# EAGLE design PlaybackStylophone (EAGLE 9.6.2)
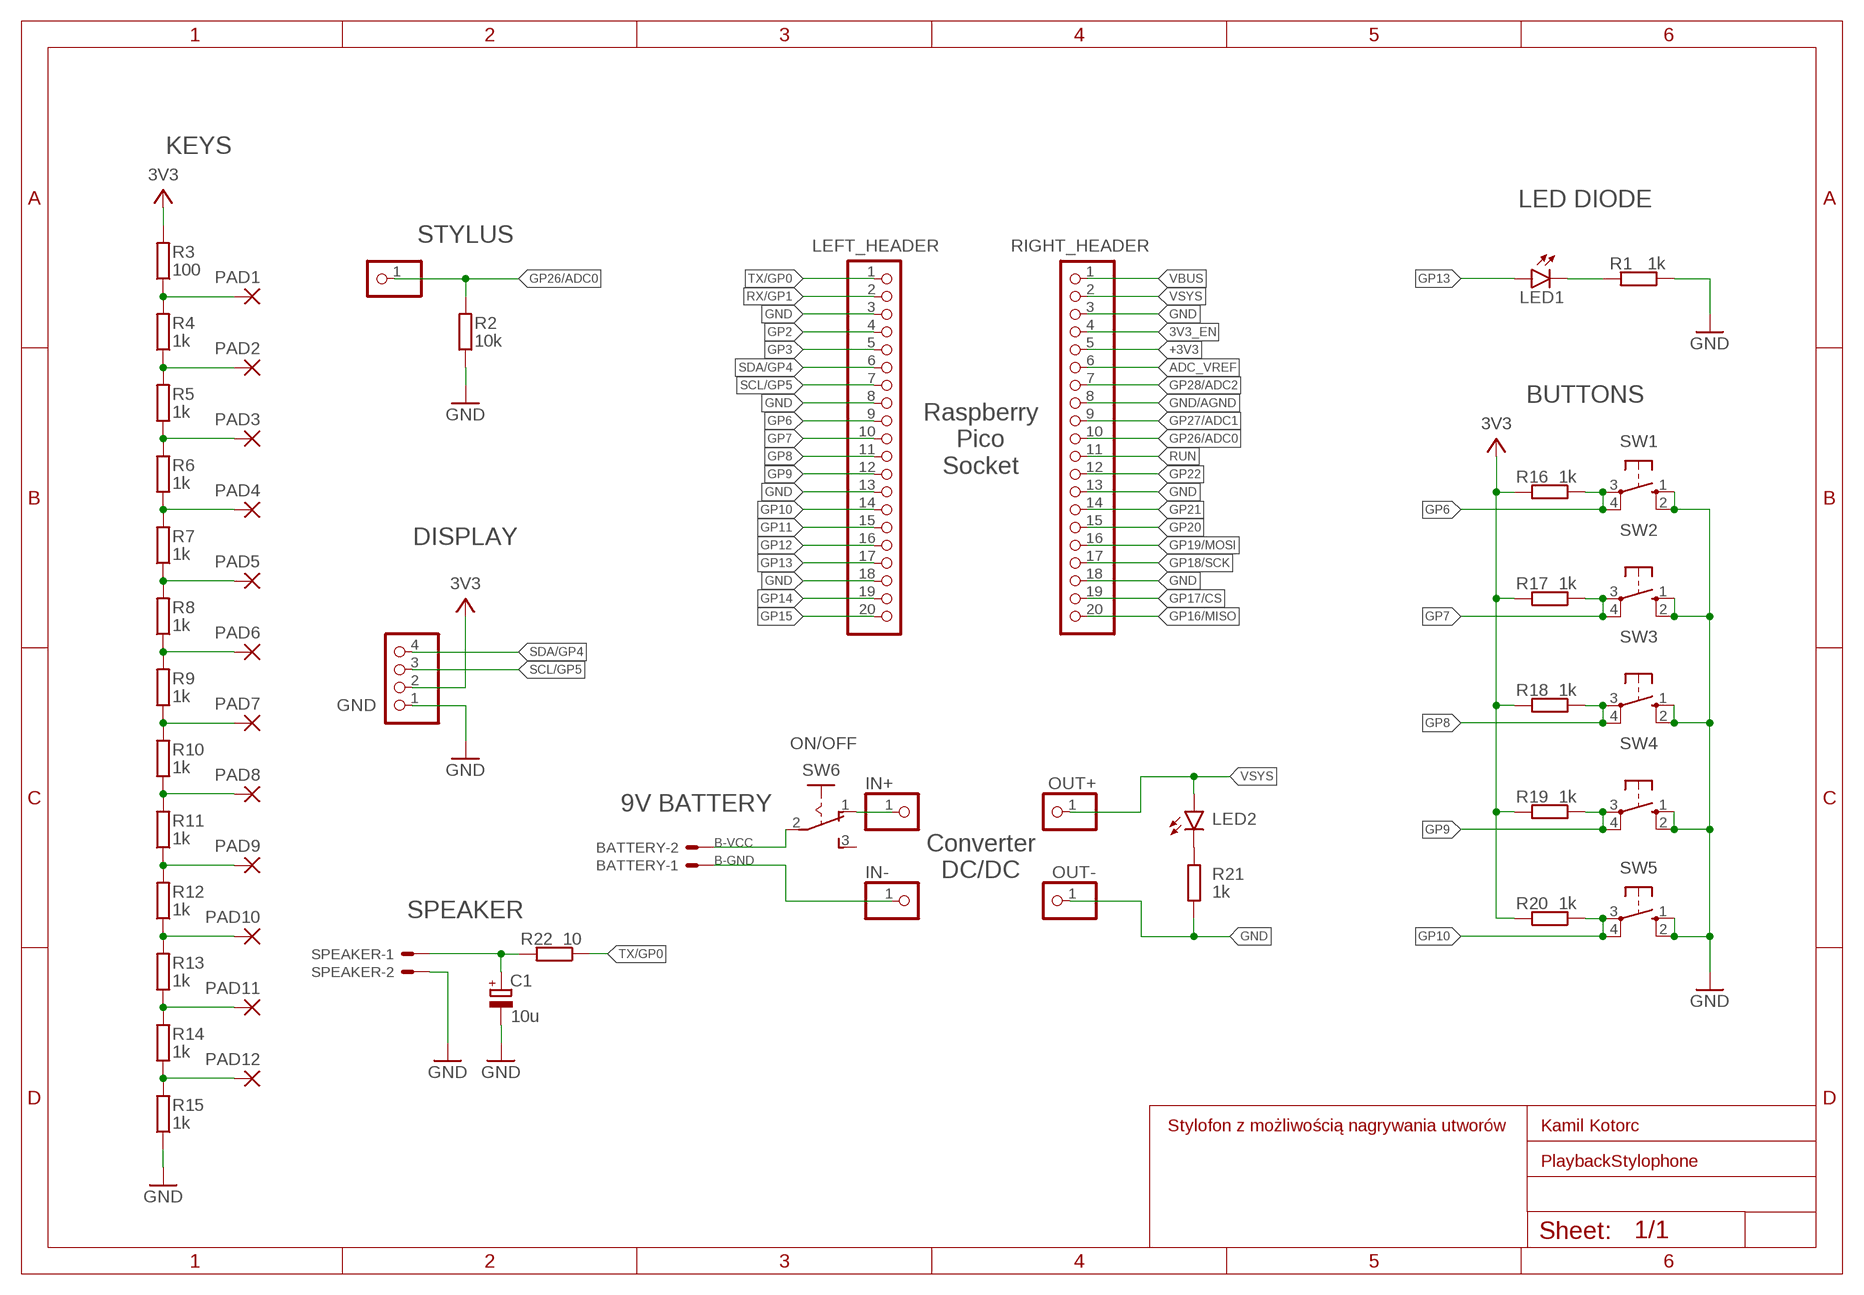
[diagram p0: schematic, sheet 1]
FRAME1 (A4L-LOC): AUTHOR: Kamil Kotorc; PROJECT: Stylofon z możliwością nagrywania utworów

## Parts
BATTERY  9V BATTERY  22-23-2021  [22-23-2021]
C1  10u  CPOL-EUE2.5-5  [E2,5-5]
DISPLAY  GND  PINHD-1X4  [1X04]
IN+  PINHD-1X1  [1X01]
IN-  PINHD-1X1  [1X01]
LED1  LED5MM  [LED5MM]
LED2  LED3MM  [LED3MM]
LEFT_HEADER  PINHD-1X20  [1X20]
OUT+  PINHD-1X1  [1X01]
OUT-  PINHD-1X1  [1X01]
PAD1  SMD5  [SMD2,54-5,08]
PAD2  SMD5  [SMD2,54-5,08]
PAD3  SMD5  [SMD2,54-5,08]
PAD4  SMD5  [SMD2,54-5,08]
PAD5  SMD5  [SMD2,54-5,08]
PAD6  SMD5  [SMD2,54-5,08]
PAD7  SMD5  [SMD2,54-5,08]
PAD8  SMD5  [SMD2,54-5,08]
PAD9  SMD5  [SMD2,54-5,08]
PAD10  SMD5  [SMD2,54-5,08]
PAD11  SMD5  [SMD2,54-5,08]
PAD12  SMD5  [SMD2,54-5,08]
R1  1k  R-EU_0204/7  [0204/7]
R2  10k  R-EU_0204/7  [0204/7]
R3  100  R-EU_0204/7  [0204/7]
R4  1k  R-EU_0204/7  [0204/7]
R5  1k  R-EU_0204/7  [0204/7]
R6  1k  R-EU_0204/7  [0204/7]
R7  1k  R-EU_0204/7  [0204/7]
R8  1k  R-EU_0204/7  [0204/7]
R9  1k  R-EU_0204/7  [0204/7]
R10  1k  R-EU_0204/7  [0204/7]
R11  1k  R-EU_0204/7  [0204/7]
R12  1k  R-EU_0204/7  [0204/7]
R13  1k  R-EU_0204/7  [0204/7]
R14  1k  R-EU_0204/7  [0204/7]
R15  1k  R-EU_0204/7  [0204/7]
R16  1k  R-EU_0204/7  [0204/7]
R17  1k  R-EU_0204/7  [0204/7]
R18  1k  R-EU_0204/7  [0204/7]
R19  1k  R-EU_0204/7  [0204/7]
R20  1k  R-EU_0204/7  [0204/7]
R21  1k  R-EU_0204/7  [0204/7]
R22  10  R-EU_0204/7  [0204/7]
RIGHT_HEADER  PINHD-1X20  [1X20]
SPEAKER  SPEAKER  22-23-2021  [22-23-2021]
STYLUS  PINHD-1X1  [1X01]
SW1  10-XX  [B3F-10XX]
SW2  10-XX  [B3F-10XX]
SW3  10-XX  [B3F-10XX]
SW4  10-XX  [B3F-10XX]
SW5  10-XX  [B3F-10XX]
SW6  ON/OFF  255SB  [255SB]

## Nets
3V3_EN: RIGHT_HEADER.4
+3V3: DISPLAY.2 R3.2 R16.2 R17.2 R18.2 R19.2 R20.2 RIGHT_HEADER.5 ; supply symbol labelled 3V3
ADC_VREF: RIGHT_HEADER.6
B-GND: BATTERY.1 IN-.1
B-SW: IN+.1 SW6.1(O)
B-VCC: BATTERY.2 SW6.2(P)
GND: C1.- DISPLAY.1 LEFT_HEADER.3 LEFT_HEADER.8 LEFT_HEADER.13 LEFT_HEADER.18 OUT-.1 R1.1 R2.1 R15.1 R21.1 RIGHT_HEADER.3 RIGHT_HEADER.13 RIGHT_HEADER.18 SPEAKER.2 SW1.1(S) SW1.2(S1) SW2.1(S) SW2.2(S1) SW3.1(S) SW3.2(S1) SW4.1(S) SW4.2(S1) SW5.1(S) SW5.2(S1)
GND/AGND: RIGHT_HEADER.8
GP2: LEFT_HEADER.4
GP3: LEFT_HEADER.5
GP6: LEFT_HEADER.9 R16.1 SW1.3(P) SW1.4(P1)
GP7: LEFT_HEADER.10 R17.1 SW2.3(P) SW2.4(P1)
GP8: LEFT_HEADER.11 R18.1 SW3.3(P) SW3.4(P1)
GP9: LEFT_HEADER.12 R19.1 SW4.3(P) SW4.4(P1)
GP10: LEFT_HEADER.14 R20.1 SW5.3(P) SW5.4(P1)
GP11: LEFT_HEADER.15
GP12: LEFT_HEADER.16
GP13: LED1.A LEFT_HEADER.17
GP14: LEFT_HEADER.19
GP15: LEFT_HEADER.20
GP16/MISO: RIGHT_HEADER.20
GP17/CS: RIGHT_HEADER.19
GP18/SCK: RIGHT_HEADER.17
GP19/MOSI: RIGHT_HEADER.16
GP20: RIGHT_HEADER.15
GP21: RIGHT_HEADER.14
GP22: RIGHT_HEADER.12
GP26/ADC0: R2.2 RIGHT_HEADER.10 STYLUS.1
GP27/ADC1: RIGHT_HEADER.9
GP28/ADC2: RIGHT_HEADER.7
LED: LED1.K(C) R1.2
N$1: C1.+ R22.2 SPEAKER.1
N$13: LED2.K(C) R21.2
P1: PAD1.1(P) R3.1 R4.2
P2: PAD2.1(P) R4.1 R5.2
P3: PAD3.1(P) R5.1 R6.2
P4: PAD4.1(P) R6.1 R7.2
P5: PAD5.1(P) R7.1 R8.2
P6: PAD6.1(P) R8.1 R9.2
P7: PAD7.1(P) R9.1 R10.2
P8: PAD8.1(P) R10.1 R11.2
P9: PAD9.1(P) R11.1 R12.2
P10: PAD10.1(P) R12.1 R13.2
P11: PAD11.1(P) R13.1 R14.2
P12: PAD12.1(P) R14.1 R15.2
RUN: RIGHT_HEADER.11
RX/GP1: LEFT_HEADER.2
SCL/GP5: DISPLAY.3 LEFT_HEADER.7
SDA/GP4: DISPLAY.4 LEFT_HEADER.6
TX/GP0: LEFT_HEADER.1 R22.1
VBUS: RIGHT_HEADER.1
VSYS: LED2.A OUT+.1 RIGHT_HEADER.2
Unconnected: SW6.3(S)

## Notes on the sheet
- KEYS
- LED DIODE
- BUTTONS
- Raspberry
  Pico
  Socket
- Converter
  DC/DC

## Library data of the parts
BATTERY SPEAKER = con-molex:22-23-2021: .100" (2.54mm) Center Header - 2 Pin; MF: MOLEX; MPN: 22-23-2021; OC_FARNELL: 1462926; OC_NEWARK: 25C3832
C1 = rcl:CPOL-EU: POLARIZED CAPACITOR, European symbol; SPICEPREFIX: C
DISPLAY = pinhead:PINHD-1X4: PIN HEADER
IN+ IN- OUT+ OUT- STYLUS = pinhead:PINHD-1X1: PIN HEADER
LED1 LED2 = led:LED: LED OSRAM: - CHIPLED LG R971, LG N971, LY N971, LG Q971, LY Q971, LO R971, LY R971 LH N974, LH R974 LS Q976, LO Q976, LY Q976 LO Q996 - Hyper CHIPLED LW Q18S LB Q993, LB Q99A, LB R99A - SideLED LS A670, LO A670, LY A670, LG A670, LP A670 LB A673, LV A673, LT A673, LW A673 LH A674 LY A675 LS A676, LA A676, LO A676, LY A676, LW A676 LS A679, LY A679, LG A679 - Hyper Micro SIDELED® LS Y876, LA Y876, LO Y876, LY Y876 LT Y87S - SmartLED LW L88C, LW L88S LB L89C, LB L89S, LG L890 LS L89K, LO L89K, LY L89K LS L896, LA L896, LO L896, LY L896 - TOPLED LS T670, LO T670, LY T670, LG T670, LP T670 LSG T670, LSP T670, LSY T670, LOP T670, LYG T670 LG T671, LOG T671, LSG T671 LB T673, LV T673, LT T673, LW T673 LH T674 LS T676, LA T676, LO T676, LY T676, LB T676, LH T676, LSB T676, LW T676 LB T67C, LV T67C, LT T67C, LS T67K, LO T67K, LY T67K, LW E67C LS E67B, LA E67B, LO E67B, LY E67B, LB E67C, LV E67C, LT E67C LW T67C LS T679, LY T679, LG T679 LS T770, LO T770, LY T770, LG T770, LP T770 LB T773, LV T773, LT T773, LW T773 LH T774 LS E675, LA E675, LY E675, LS T675 LS T776, LA T776, LO T776, LY T776, LB T776 LHGB T686 LT T68C, LB T68C - Hyper Mini TOPLED® LB M676 - Mini TOPLED Santana® LG M470 LS M47K, LO M47K, LY M47K Source: http://www.osram.convergy.de LUXEON: - LUMILED® LXK2-PW12-R00, LXK2-PW12-S00, LXK2-PW14-U00, LXK2-PW14-V00 LXK2-PM12-R00, LXK2-PM12-S00, LXK2-PM14-U00 LXK2-PE12-Q00, LXK2-PE12-R00, LXK2-PE12-S00, LXK2-PE14-T00, LXK2-PE14-U00 LXK2-PB12-K00, LXK2-PB12-L00, LXK2-PB12-M00, LXK2-PB14-N00, LXK2-PB14-P00, LXK2-PB14-Q00 LXK2-PR12-L00, LXK2-PR12-M00, LXK2-PR14-Q00, LXK2-PR14-R00 LXK2-PD12-Q00, LXK2-PD12-R00, LXK2-PD12-S00 LXK2-PH12-R00, LXK2-PH12-S00 LXK2-PL12-P00, LXK2-PL12-Q00, LXK2-PL12-R00 Source: www.luxeon.com KINGBRIGHT: KA-3528ASYC Source: www.kingbright.com
LEFT_HEADER RIGHT_HEADER = pinhead:PINHD-1X20: PIN HEADER
PAD1-PAD12 = wirepad:SMD5: SMD PAD
R1-R22 = rcl:R-EU_: RESISTOR, European symbol; SPICEPREFIX: R
SW1-SW5 = switch-omron:10-XX: OMRON SWITCH; MPN: B3F-1000; OC_FARNELL: 176432; OC_NEWARK: 36M3542
SW6 = switch:255SB: SLIDING SWITCH Distributor Buerklin, 11G810

## Board
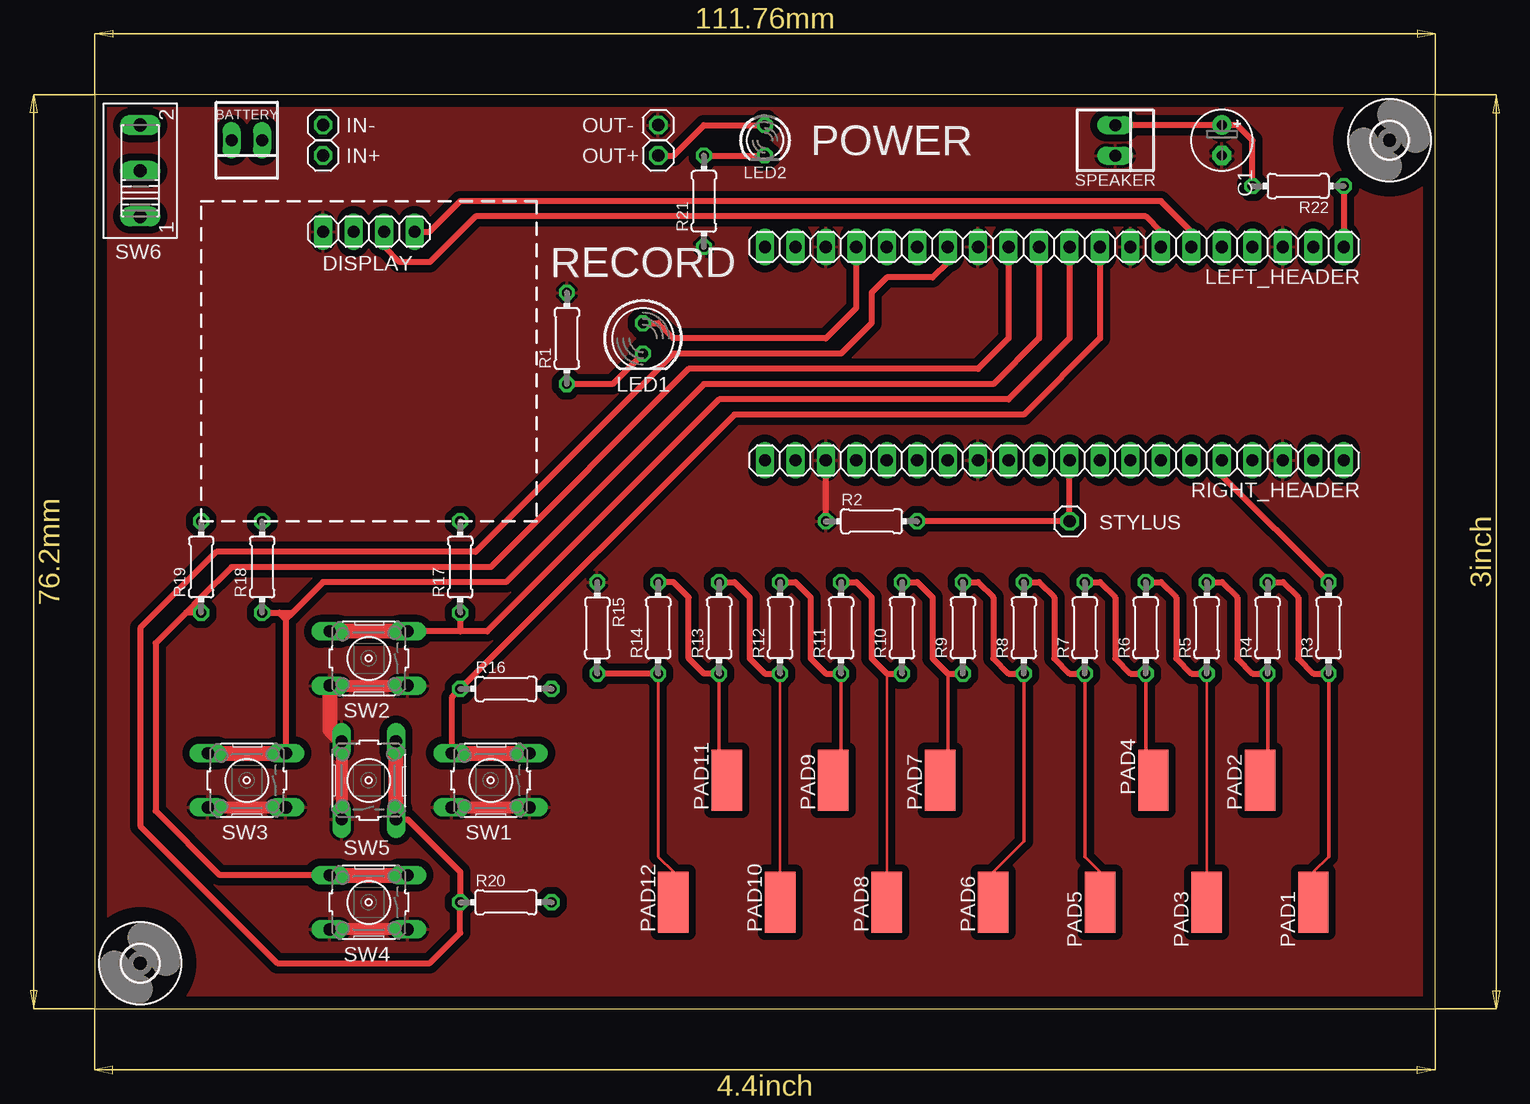
[diagram p1: board, top side]
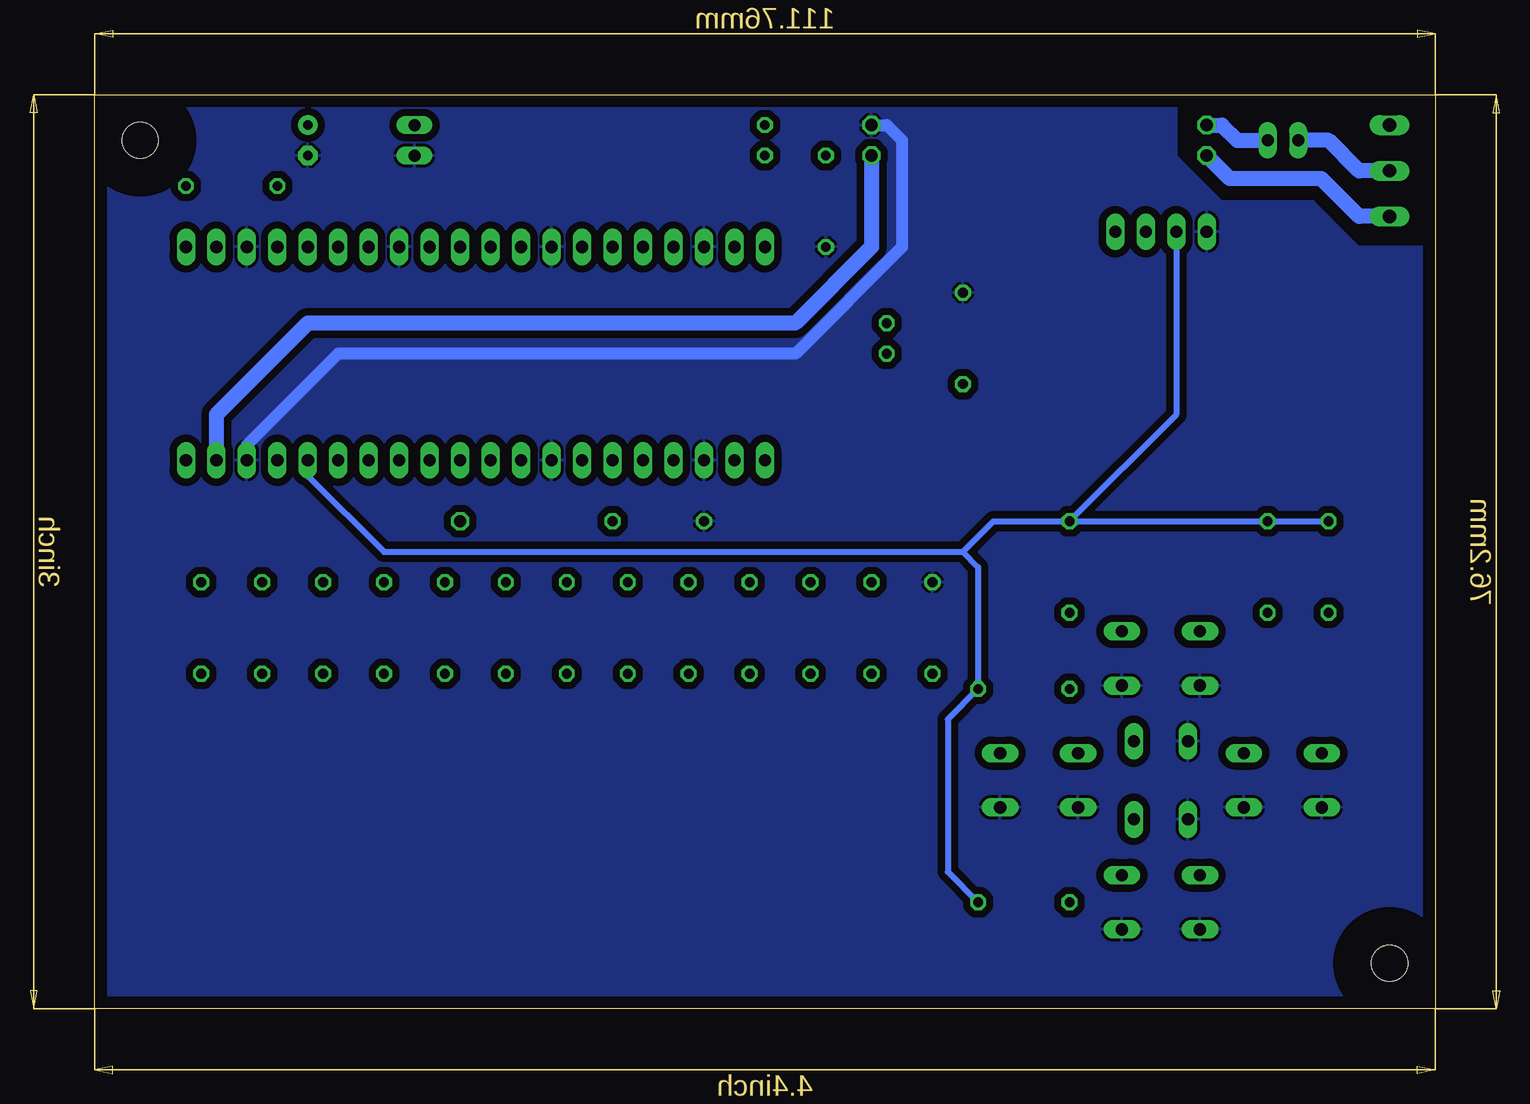
[diagram p2: board, bottom side, seen from below]

Size 111.76 x 76.2 mm. Coordinates in mm from the lower left corner, seen from the top.
Outline: 0,0 111.76,0 111.76,76.2 0,76.2 0,0
Copper layers (1*16): Top 0.035mm / dielectric 1.5mm / Bottom 0.035mm
Design rules "default": minimum track width 6mil, minimum drill 0.35mm, track to track 6mil, track to pad 6mil, pad to pad 6mil, via to via 6mil, smd to smd 6mil, copper to edge 40mil, drill to drill 6mil, minimum pad ring 10mil, minimum via ring 8mil, stop-mask expansion 4mil, vias tented up to drill 0mil, thermal gap 10mil

### Footprints (pad centres in the part's own frame; a part is rotated, then mirrored left to right if it is on the bottom)
22-23-2021 = drill 1 long: 1 -1.27,0; 2 1.27,0
E2,5-5 = drill 0.813 pad 1.6: + -1.27,0 | drill 0.813 pad 1.6 octagon: - 1.27,0
1X04 = drill 1.016 long: 1 -3.81,0; 2 -1.27,0; 3 1.27,0; 4 3.81,0
1X01 = drill 1.016 octagon: 1 0,0
LED5MM = drill 0.813 octagon: A -1.27,0; K 1.27,0
LED3MM = drill 0.813 octagon: A -1.27,0; K 1.27,0
1X20 = drill 1.016 long: 1 -24.13,0; 2 -21.59,0; 3 -19.05,0; 4 -16.51,0; 5 -13.97,0; 6 -11.43,0; 7 -8.89,0; 8 -6.35,0; 9 -3.81,0; 10 -1.27,0; 11 1.27,0; 12 3.81,0; 13 6.35,0; 14 8.89,0; 15 11.43,0; 16 13.97,0; 17 16.51,0; 18 19.05,0; 19 21.59,0; 20 24.13,0
SMD2,54-5,08 = smd 2.54 x 5.08: 1 0,0
0204/7 = drill 0.813 octagon: 1 -3.81,0; 2 3.81,0
B3F-10XX = drill 1.016 long: 1 -3.251,2.261; 2 3.251,2.261; 3 -3.251,-2.261; 4 3.251,-2.261
255SB = drill 1.118 long: 1 -3.81,0; 2 0,0; 3 3.81,0
3,0 = hole 3: 0,0

### Placement (x,y rotation side)
BATTERY  12.7,72.39 180 top
C1  93.98,72.39 270 top
DISPLAY  22.86,64.77 0 top
IN+  19.05,71.12 0 top
IN-  19.05,73.66 0 top
LED1  45.72,55.88 270 top
LED2  55.88,72.39 270 top
LEFT_HEADER  80.01,63.5 180 top
OUT+  46.99,71.12 0 top
OUT-  46.99,73.66 0 top
PAD1  101.6,8.89 0 top
PAD2  97.16,19.05 0 top
PAD3  92.71,8.89 0 top
PAD4  88.27,19.05 0 top
PAD5  83.82,8.89 0 top
PAD6  74.93,8.89 0 top
PAD7  70.48,19.05 0 top
PAD8  66.04,8.89 0 top
PAD9  61.59,19.05 0 top
PAD10  57.15,8.89 0 top
PAD11  52.7,19.05 0 top
PAD12  48.26,8.89 0 top
R1  39.37,55.88 270 top
R2  64.77,40.64 0 top
R3  102.87,31.75 90 top
R4  97.79,31.75 90 top
R5  92.71,31.75 90 top
R6  87.63,31.75 90 top
R7  82.55,31.75 90 top
R8  77.47,31.75 90 top
R9  72.39,31.75 90 top
R10  67.31,31.75 90 top
R11  62.23,31.75 90 top
R12  57.15,31.75 90 top
R13  52.07,31.75 90 top
R14  46.99,31.75 90 top
R15  41.91,31.75 270 top
R16  34.29,26.67 0 top
R17  30.48,36.83 90 top
R18  13.97,36.83 90 top
R19  8.89,36.83 90 top
R20  34.29,8.89 0 top
R21  50.8,67.31 90 top
R22  100.33,68.58 180 top
RIGHT_HEADER  80.01,45.72 180 top
SPEAKER  85.09,72.39 270 top
STYLUS  81.28,40.64 0 top
SW1  33.02,19.05 180 top
SW2  22.86,29.21 180 top
SW3  12.7,19.05 180 top
SW4  22.86,8.89 180 top
SW5  22.86,19.05 90 top
SW6  3.81,69.85 90 top
U$1  [3,0]  3.81,3.81 0 top
U$2  [3,0]  107.95,72.39 0 top

### Tracks (layer width: path | path; a pad name or v marks a point on that pad's centre or on a via)
+3V3
  Top 0.508: R3.2 93.98,44.45 RIGHT_HEADER.5
  Bottom 0.508: RIGHT_HEADER.5 93.98,44.45 87.63,38.1 39.37,38.1 | 39.37,38.1 38.1,36.83 R16.2 40.64,24.13 40.64,11.43 R20.2 | 39.37,38.1 36.83,40.64 R17.2 | R17.2 R18.2 R19.2 | DISPLAY.2 21.59,49.53 R17.2
B-GND
  Bottom 1.27: IN-.1 17.78,73.66 16.51,72.39 BATTERY.1
B-SW
  Bottom 1.27: SW6.1 6.35,66.04 9.53,69.22 17.14,69.22 IN+.1
B-VCC
  Bottom 1.27: SW6.2 6.35,69.85 8.89,72.39 BATTERY.2
GND
  Top 0.508: R2.1 RIGHT_HEADER.18
  Top 1.016: SW4.1 SW4.2 | SW5.2 SW5.1 | SW1.2 SW1.1 | SW3.2 SW3.1 | SW2.2 SW2.1
  Top 1.27: SW2.2 19.61,23.29 SW5.2
  Bottom 1.016: OUT-.1 45.72,73.66 44.45,72.39 44.45,63.5 53.34,54.61 91.44,54.61 99.06,46.99 RIGHT_HEADER.3
  pour Bottom (isolate 0.61): 113.03,77.47 113.03,-1.27 -1.27,-1.27 -1.27,63.5 6.35,63.5 10.16,67.31 17.78,67.31 21.59,71.12 21.59,77.47
  pour Top (isolate 0.61): 0,76.2 111.76,76.2 111.76,0 0,0
GP6
  Top 0.508: LEFT_HEADER.9 83.82,55.88 77.47,49.53 53.34,49.53 R16.1 29.77,25.96 SW1.4
  Top 1.27: SW1.4 SW1.3
GP7
  Top 0.508: LEFT_HEADER.10 81.28,55.88 76.2,50.8 52.07,50.8 32.74,31.47 30.48,31.47 | 30.48,31.47 SW2.3 | R17.1 30.48,31.47
  Top 1.27: SW2.3 SW2.4
GP8
  Top 0.508: LEFT_HEADER.11 78.74,55.88 74.93,52.07 50.8,52.07 34.29,35.56 19.05,35.56 16.51,33.02 | 15.95,32.46 SW3.3 | 16.51,33.02 15.95,32.46 | 15.95,32.46 15.39,33.02 R18.1 16.51,33.02
  Top 1.27: SW3.4 SW3.3
GP9
  Top 0.508: LEFT_HEADER.12 76.2,55.88 73.66,53.34 49.53,53.34 33.02,36.83 11.43,36.83 8.89,34.29 | SW4.4 10.44,11.15 5.08,16.51 5.08,30.48 7.62,33.02 | 8.89,34.29 7.62,33.02 | 8.89,34.29 R19.1 7.62,33.02
  Top 1.27: SW4.4 SW4.3
GP10
  Top 0.508: LEFT_HEADER.14 71.12,62.23 69.85,60.96 66.04,60.96 64.77,59.69 64.77,57.15 62.23,54.61 48.26,54.61 31.75,38.1 10.16,38.1 3.81,31.75 3.81,15.24 15.24,3.81 27.94,3.81 30.48,6.35 R20.1 30.48,11.43 26.11,15.8 SW5.3
  Top 1.27: SW5.3 SW5.4
GP13
  Top 0.508: LED1.A 46.99,57.15 48.26,55.88 60.96,55.88 63.5,58.42 LEFT_HEADER.17
GP26/ADC0
  Top 0.508: R2.2 STYLUS.1 RIGHT_HEADER.10
LED
  Top 0.508: LED1.K 43.18,52.07 R1.2
N$1
  Top 0.508: R22.2 96.52,72.39 95.25,73.66 C1.+ SPEAKER.1
N$13
  Top 0.508: R21.2 LED2.K
P1
  Top 0.254: 102.87,12.7 101.6,11.43 PAD1.1
  Top 0.305: R3.1 102.87,12.7
  Top 0.508: R4.2 99.06,35.56 100.33,34.29 100.33,29.21 101.6,27.94 R3.1
P2
  Top 0.254: PAD2.1 97.79,19.68
  Top 0.305: 97.79,19.68 R4.1
  Top 0.508: R5.2 93.98,35.56 95.25,34.29 95.25,29.21 96.52,27.94 R4.1
P3
  Top 0.203: PAD3.1 R5.1
  Top 0.508: R6.2 88.9,35.56 90.17,34.29 90.17,29.21 91.44,27.94 R5.1
P4
  Top 0.254: PAD4.1 87.63,19.68
  Top 0.305: 87.63,19.68 R6.1
  Top 0.508: R7.2 83.82,35.56 85.09,34.29 85.09,29.21 86.36,27.94 R6.1
P5
  Top 0.254: 82.55,12.7 83.82,11.43 PAD5.1
  Top 0.305: R7.1 82.55,12.7
  Top 0.508: R8.2 78.74,35.56 80.01,34.29 80.01,29.21 81.28,27.94 R7.1
P6
  Top 0.254: 77.47,13.97 74.93,11.43 PAD6.1
  Top 0.305: R8.1 77.47,13.97
  Top 0.508: R9.2 73.66,35.56 74.93,34.29 74.93,29.21 76.2,27.94 R8.1
P7
  Top 0.254: PAD7.1 71.12,19.68
  Top 0.305: 71.12,19.68 71.12,27.94
  Top 0.508: R10.2 68.58,35.56 69.85,34.29 69.85,29.21 71.12,27.94 R9.1
P8
  Top 0.203: PAD8.1 66.04,27.94
  Top 0.508: R11.2 63.5,35.56 64.77,34.29 64.77,29.21 66.04,27.94 R10.1
P9
  Top 0.254: PAD9.1 62.23,19.68
  Top 0.305: 62.23,19.68 R11.1
  Top 0.508: R12.2 58.42,35.56 59.69,34.29 59.69,29.21 60.96,27.94 R11.1
P10
  Top 0.203: PAD10.1 R12.1
  Top 0.508: R13.2 53.34,35.56 54.61,34.29 54.61,29.21 55.88,27.94 R12.1
P11
  Top 0.254: PAD11.1 52.07,19.68
  Top 0.305: 52.07,19.68 R13.1
  Top 0.508: R13.1 50.8,27.94 49.53,29.21 49.53,34.29 48.26,35.56 R14.2
P12
  Top 0.254: R14.1 46.99,12.7 48.26,11.43 PAD12.1
  Top 0.508: R14.1 R15.2
SCL/GP5
  Top 0.508: LEFT_HEADER.7 88.9,64.77 87.63,66.04 31.75,66.04 27.94,62.23 25.4,62.23 24.13,63.5 DISPLAY.3
SDA/GP4
  Top 0.508: LEFT_HEADER.6 91.44,64.77 88.9,67.31 30.48,67.31 27.94,64.77 DISPLAY.4
TX/GP0
  Top 0.508: R22.1 LEFT_HEADER.1
VSYS
  Top 0.508: OUT+.1 48.26,71.12 50.8,73.66 LED2.A
  Bottom 1.27: OUT+.1 46.99,63.5 53.34,57.15 93.98,57.15 101.6,49.53 RIGHT_HEADER.2

### Text on the board
tNames: POWER | RECORD